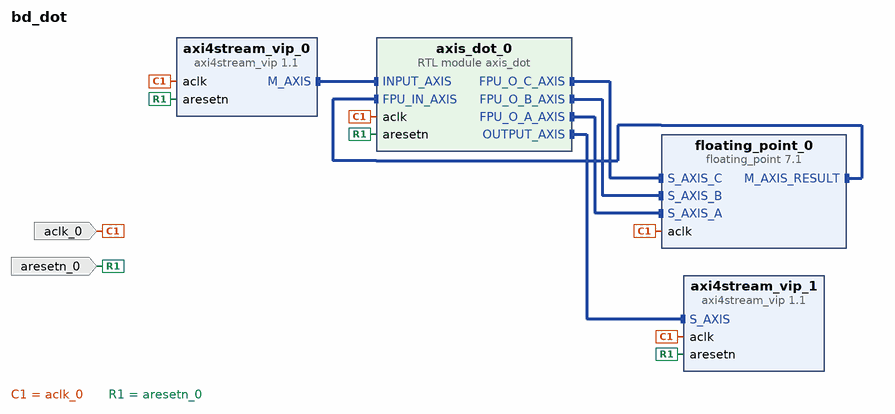
[diagram p0: block diagram of the top level]
# Vivado block design bd_dot, xc7z020clg400-1, Vivado 2018.3
create_bd_design bd_dot

create_bd_port -dir I -type clk aclk_0
create_bd_port -dir I -type rst aresetn_0

create_bd_cell -type ip -vlnv xilinx.com:ip:floating_point:7.1 floating_point_0
set_property -dict [list \
  CONFIG.Add_Sub_Value Add \
  CONFIG.C_Latency 17 \
  CONFIG.C_Mult_Usage Medium_Usage \
  CONFIG.C_Rate 1 \
  CONFIG.C_Result_Exponent_Width 8 \
  CONFIG.C_Result_Fraction_Width 24 \
  CONFIG.Has_A_TLAST true \
  CONFIG.Maximum_Latency true \
  CONFIG.Operation_Type FMA \
  CONFIG.RESULT_TLAST_Behv Pass_A_TLAST \
  CONFIG.Result_Precision_Type Single \
] [get_bd_cells floating_point_0]
create_bd_cell -type ip -vlnv xilinx.com:ip:axi4stream_vip:1.1 axi4stream_vip_0
set_property -dict [list \
  CONFIG.HAS_TKEEP 0 \
  CONFIG.HAS_TLAST 0 \
  CONFIG.HAS_TREADY 1 \
  CONFIG.HAS_TSTRB 0 \
  CONFIG.INTERFACE_MODE MASTER \
  CONFIG.TDATA_NUM_BYTES 4 \
  CONFIG.TDEST_WIDTH 0 \
  CONFIG.TID_WIDTH 0 \
  CONFIG.TUSER_WIDTH 0 \
] [get_bd_cells axi4stream_vip_0]
create_bd_cell -type ip -vlnv xilinx.com:ip:axi4stream_vip:1.1 axi4stream_vip_1
set_property -dict {CONFIG.INTERFACE_MODE SLAVE} [get_bd_cells axi4stream_vip_1]
create_bd_cell -type module -reference axis_dot axis_dot_0

# ---- connections ----

connect_bd_intf_net [get_bd_intf_pins axis_dot_0/FPU_O_C_AXIS] [get_bd_intf_pins floating_point_0/S_AXIS_C]
connect_bd_intf_net [get_bd_intf_pins axis_dot_0/OUTPUT_AXIS] [get_bd_intf_pins axi4stream_vip_1/S_AXIS]
connect_bd_intf_net [get_bd_intf_pins axis_dot_0/FPU_O_B_AXIS] [get_bd_intf_pins floating_point_0/S_AXIS_B]
connect_bd_intf_net [get_bd_intf_pins floating_point_0/M_AXIS_RESULT] [get_bd_intf_pins axis_dot_0/FPU_IN_AXIS]
connect_bd_intf_net [get_bd_intf_pins axis_dot_0/FPU_O_A_AXIS] [get_bd_intf_pins floating_point_0/S_AXIS_A]
connect_bd_intf_net [get_bd_intf_pins axi4stream_vip_0/M_AXIS] [get_bd_intf_pins axis_dot_0/INPUT_AXIS]
connect_bd_net -net aclk_0_1 [get_bd_ports aclk_0] \
  [get_bd_pins floating_point_0/aclk] [get_bd_pins axi4stream_vip_0/aclk] [get_bd_pins axi4stream_vip_1/aclk] \
  [get_bd_pins axis_dot_0/aclk]
connect_bd_net -net aresetn_0_1 [get_bd_ports aresetn_0] \
  [get_bd_pins axi4stream_vip_1/aresetn] [get_bd_pins axi4stream_vip_0/aresetn] [get_bd_pins axis_dot_0/aresetn]

validate_bd_design
save_bd_design
